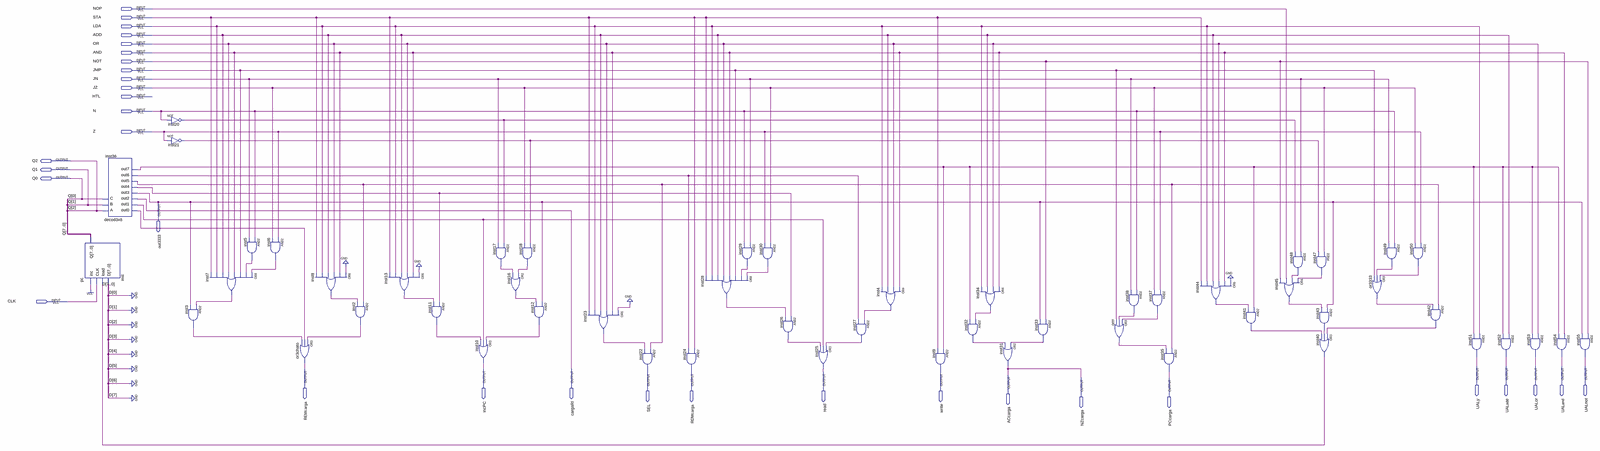
[diagram p0: schematic sheet, whole]
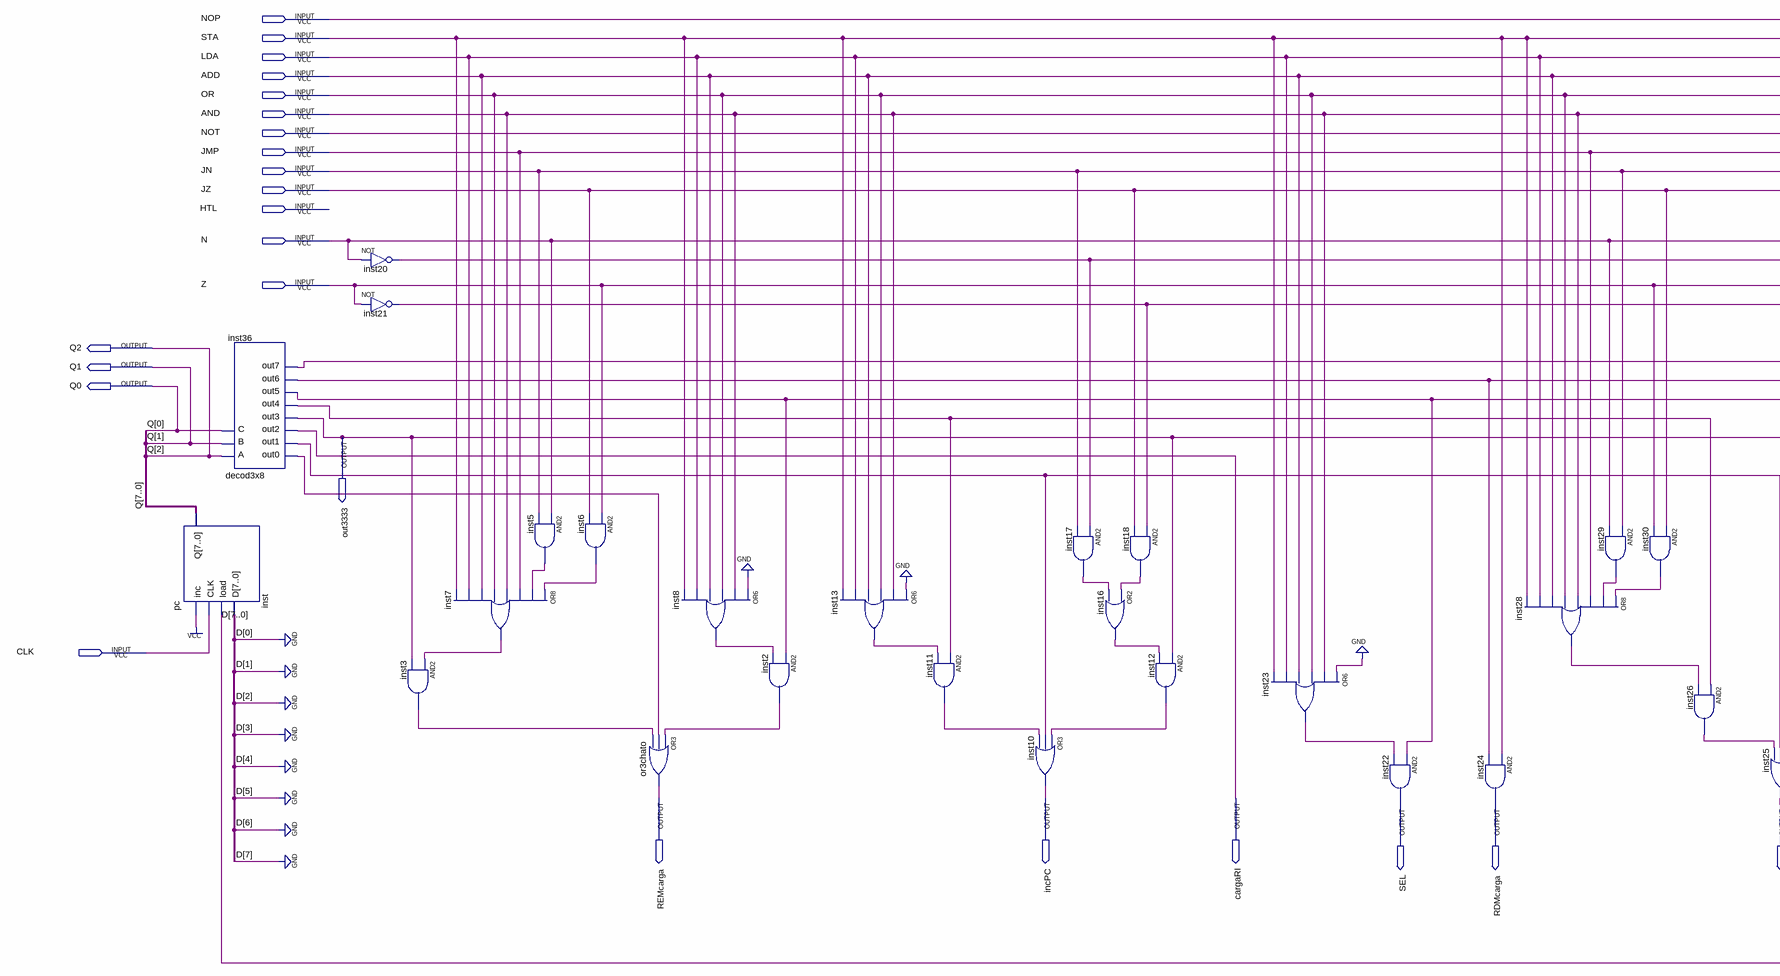
[diagram p1: schematic sheet, left part]
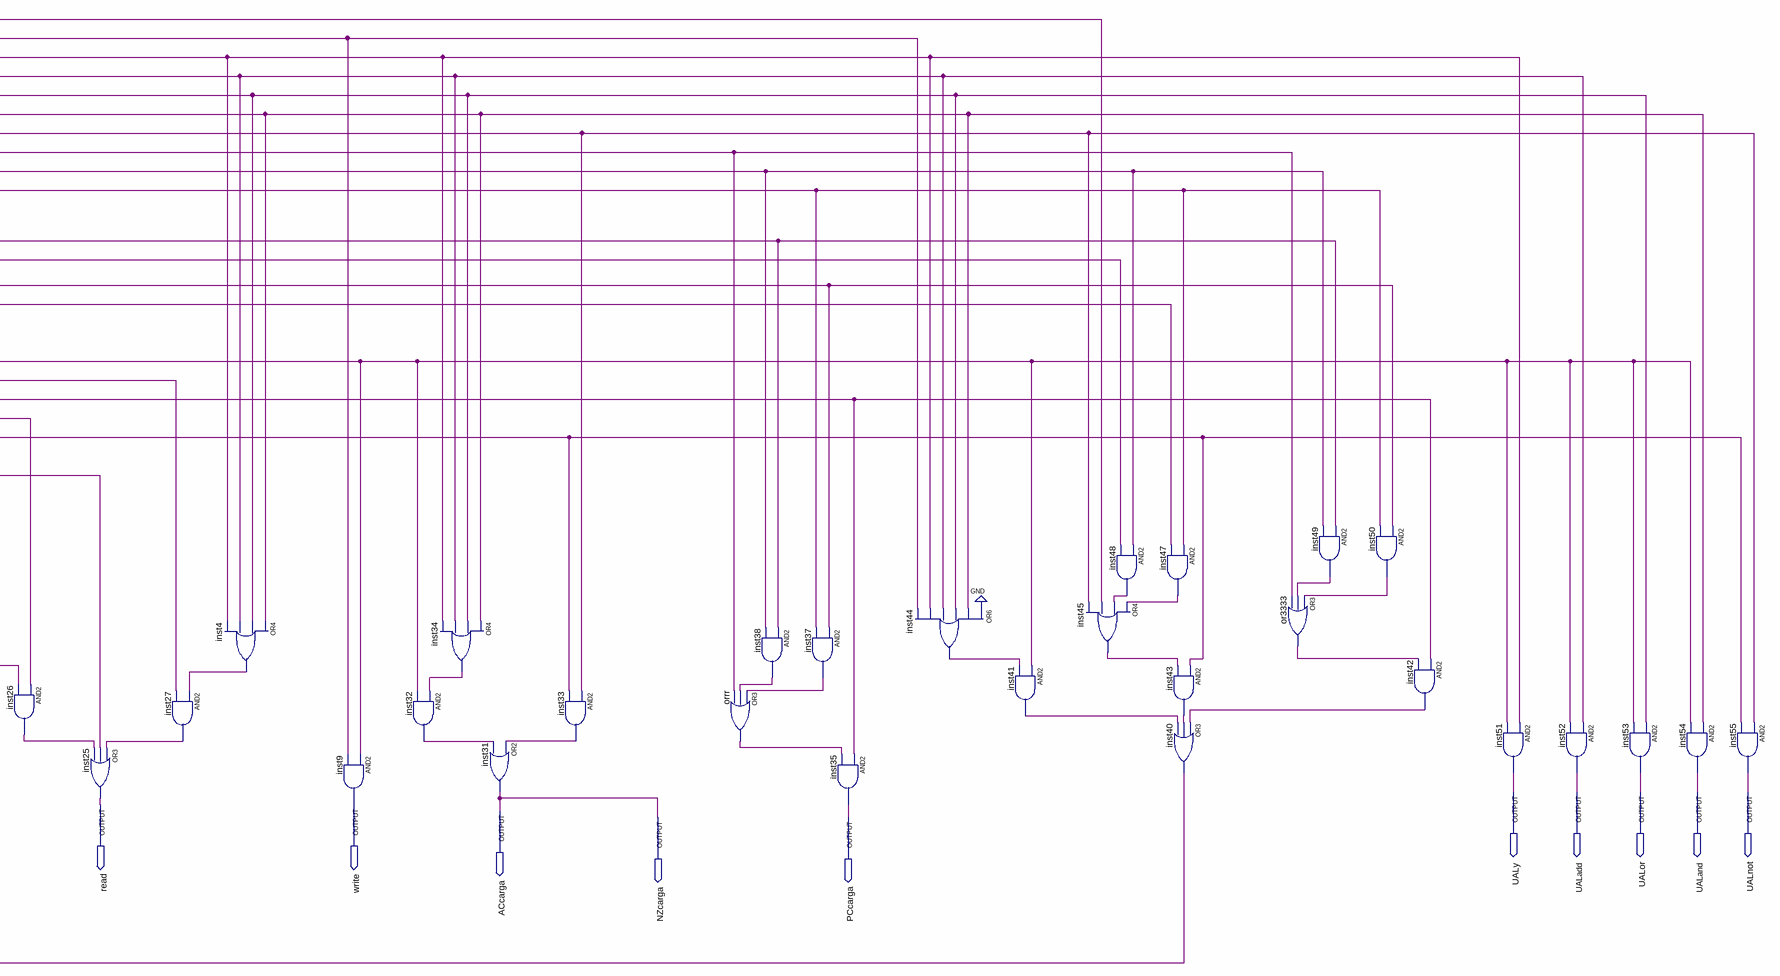
[diagram p2: schematic sheet, right part]
// Quartus schematic uctop.bdf as structural Verilog: 53 symbols, 33 pins
module uctop (
  input  NOP,
  input  STA,
  input  LDA,
  input  ADD,
  input  OR,
  input  AND,
  input  NOT,
  input  JMP,
  input  JN,
  input  JZ,
  input  HTL,
  input  N,
  input  Z,
  input  CLK,
  output Q2,
  output Q1,
  output Q0,
  output out3333,
  output UALy,
  output UALadd,
  output UALor,
  output UALand,
  output UALnot,
  output REMcarga,
  output incPC,
  output cargaRI,
  output SEL,
  output RDMcarga,
  output read,
  output write,
  output ACcarga,
  output NZcarga,
  output PCcarga
);

  wire inst2_out, inst3_out, inst4_out, inst5_out, inst6_out, inst7_out, inst8_out, inst11_out, inst12_out,
       inst13_out, inst16_out, inst17_out, inst18_out, inst20_out, inst21_out, inst23_out, inst26_out,
       inst27_out, inst28_out, inst29_out, inst30_out, inst32_out, inst33_out, inst34_out, inst36_out0,
       inst36_out1, inst36_out4, inst36_out5, inst36_out6, inst36_out7, inst37_out, inst38_out, inst40_out,
       inst41_out, inst42_out, inst43_out, inst44_out, inst45_out, inst47_out, inst48_out, inst49_out,
       inst50_out, or3333_out, orrr_out;
  wire [7:3] Q;

  pc inst (.inc(1'b1), .CLK(CLK), .load(inst40_out), .D({8{1'b0}}), .Q({Q, Q2, Q1, Q0}));
  decod3x8 inst36 (
    .A(Q2), .B(Q1), .C(Q0), .out0(inst36_out0), .out1(inst36_out1), .out2(cargaRI), .out3(out3333),
    .out4(inst36_out4), .out5(inst36_out5), .out6(inst36_out6), .out7(inst36_out7));
  not inst20 (inst20_out, N);
  not inst21 (inst21_out, Z);
  or inst7 (inst7_out, inst6_out, inst5_out, JMP, AND, OR, ADD, LDA, STA);
  and inst3 (inst3_out, inst7_out, out3333);
  and inst5 (inst5_out, N, JN);
  and inst6 (inst6_out, Z, JZ);
  or or3chato (REMcarga, inst2_out, inst36_out0, inst3_out);
  or inst8 (inst8_out, 1'b0, AND, OR, ADD, LDA, STA);
  and inst2 (inst2_out, inst36_out5, inst8_out);
  or inst13 (inst13_out, 1'b0, AND, OR, ADD, LDA, STA);
  and inst11 (inst11_out, inst36_out4, inst13_out);
  or inst10 (incPC, inst12_out, inst36_out1, inst11_out);
  and inst17 (inst17_out, inst20_out, JN);
  or inst16 (inst16_out, inst18_out, inst17_out);
  and inst18 (inst18_out, inst21_out, JZ);
  and inst12 (inst12_out, out3333, inst16_out);
  or inst23 (inst23_out, 1'b0, AND, OR, ADD, LDA, STA);
  and inst22 (SEL, inst36_out5, inst23_out);
  and inst24 (RDMcarga, STA, inst36_out6);
  or inst28 (inst28_out, inst30_out, inst29_out, JMP, AND, OR, ADD, LDA, STA);
  and inst29 (inst29_out, JN, N);
  and inst30 (inst30_out, JZ, Z);
  and inst26 (inst26_out, inst36_out4, inst28_out);
  or inst25 (read, inst27_out, inst36_out1, inst26_out);
  and inst27 (inst27_out, inst4_out, inst36_out6);
  or inst4 (inst4_out, AND, OR, ADD, LDA);
  and inst9 (write, inst36_out7, STA);
  or inst34 (inst34_out, AND, OR, ADD, LDA);
  and inst32 (inst32_out, inst34_out, inst36_out7);
  or inst31 (ACcarga, inst33_out, inst32_out);
  and inst33 (inst33_out, NOT, out3333);
  or orrr (orrr_out, inst37_out, inst38_out, JMP);
  and inst38 (inst38_out, N, JN);
  and inst37 (inst37_out, Z, JZ);
  and inst35 (PCcarga, inst36_out5, orrr_out);
  or inst44 (inst44_out, 1'b0, AND, OR, ADD, LDA, STA);
  and inst41 (inst41_out, inst36_out7, inst44_out);
  or inst45 (inst45_out, inst47_out, inst48_out, NOP, NOT);
  and inst48 (inst48_out, JN, inst20_out);
  and inst47 (inst47_out, JZ, inst21_out);
  and inst43 (inst43_out, out3333, inst45_out);
  or inst40 (inst40_out, inst42_out, inst43_out, inst41_out);
  or or3333 (or3333_out, inst50_out, inst49_out, JMP);
  and inst49 (inst49_out, N, JN);
  and inst50 (inst50_out, Z, JZ);
  and inst42 (inst42_out, inst36_out5, or3333_out);
  and inst51 (UALy, LDA, inst36_out7);
  and inst52 (UALadd, ADD, inst36_out7);
  and inst53 (UALor, OR, inst36_out7);
  and inst54 (UALand, AND, inst36_out7);
  and inst55 (UALnot, NOT, out3333);

  assign NZcarga = ACcarga;
endmodule
